# EAGLE design TBA820-Amplifier-Stripboard (EAGLE 7.2.0)
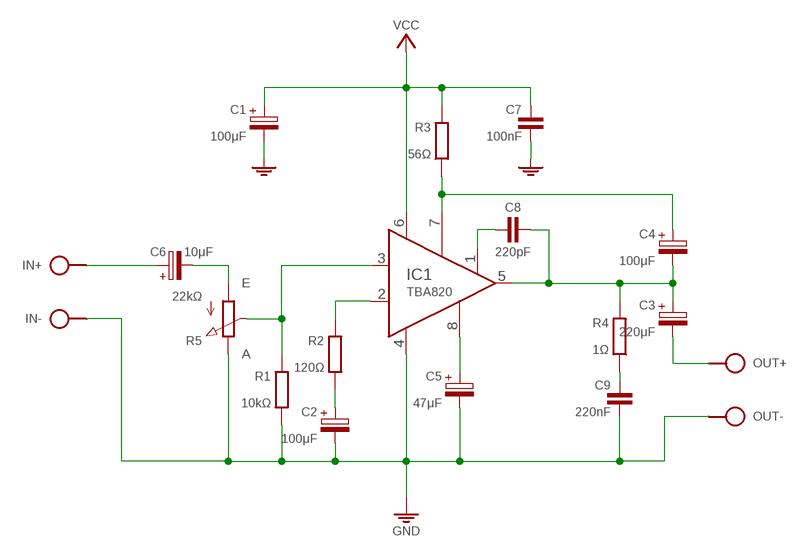
[diagram p0: schematic, sheet 1]

## Parts
C1  100μF  CPOLE2,5-4/V  [E2.5-4/V]
C2  100μF  CPOLE2,5-4/V  [E2.5-4/V]
C3  220μF  CPOLE2.5-5  [E2,5-5]
C4  100μF  CPOLE5-4  [E5-4]
C5  47μF  CPOLE2,5-3  [E2,5-3]
C6  10μF  CPOL-HE2,5-3  [E2,5-3]
C7  100nF  C025-024X044  [C025-024X044]
C8  220pF  C-H050-024X044/V  [C050-024X044/V]
C9  220nF  C075-020X044  [C075-020X044]
IC1  TBA820  [DIL08]
IN  SPAD+--+  [SPAD-+]
OUT  SPAD+-+-  [SPAD+-]
R1  10kΩ  R0202/2V  [0202/2V]
R2  120Ω  R0204/10-V  [0204/10-V]
R3  56Ω  R0202/2V  [0202/2V]
R4  1Ω  R0204/10-V  [0204/10-V]
R5  22kΩ  POT-3P  [CONN-3P]
S4  VCC_GNDPWR-R  [PWR-R]

## Nets
BOOT: C4.+ IC1.7(BOOT) R3.2
FREQ: C8.1 IC1.1(FREQ)
GAIN: IC1.2(GAIN) R2.1
GND: C1.- C2.- C5.- C7.2 C9.2 IC1.4(GND) IN.1 OUT.1 R1.2 R5.3(E) S4.1
INPUT: IC1.3(INPUT) R1.1 R5.2(S)
N$4: C9.1 R4.2
N$5: C6.- R5.1(A)
N$6: C6.+ IN.2
N$10: C3.- OUT.2
N$11: C2.+ R2.2
OUT: C3.+ C4.- C8.2 IC1.5(OUT) R4.1
RIPPLE: C5.+ IC1.8(RIPPLE)
VCC: C1.+ C7.1 IC1.6(VCC) R3.1 S4.2

## Library data of the parts
C1-C5 = c:CPOL: POLARIZED CAPACITOR, European symbol
C6 = c:CPOL-H
C7 C9 = c:C: CAPACITOR, European symbol
C8 = c:C-H
IC1 = ic:TBA820
IN OUT = pad:SPAD+-
R1-R4 = r:R: RESISTOR, European symbol
R5 = r:POT
S4 = pad:VCC_GND

## Board
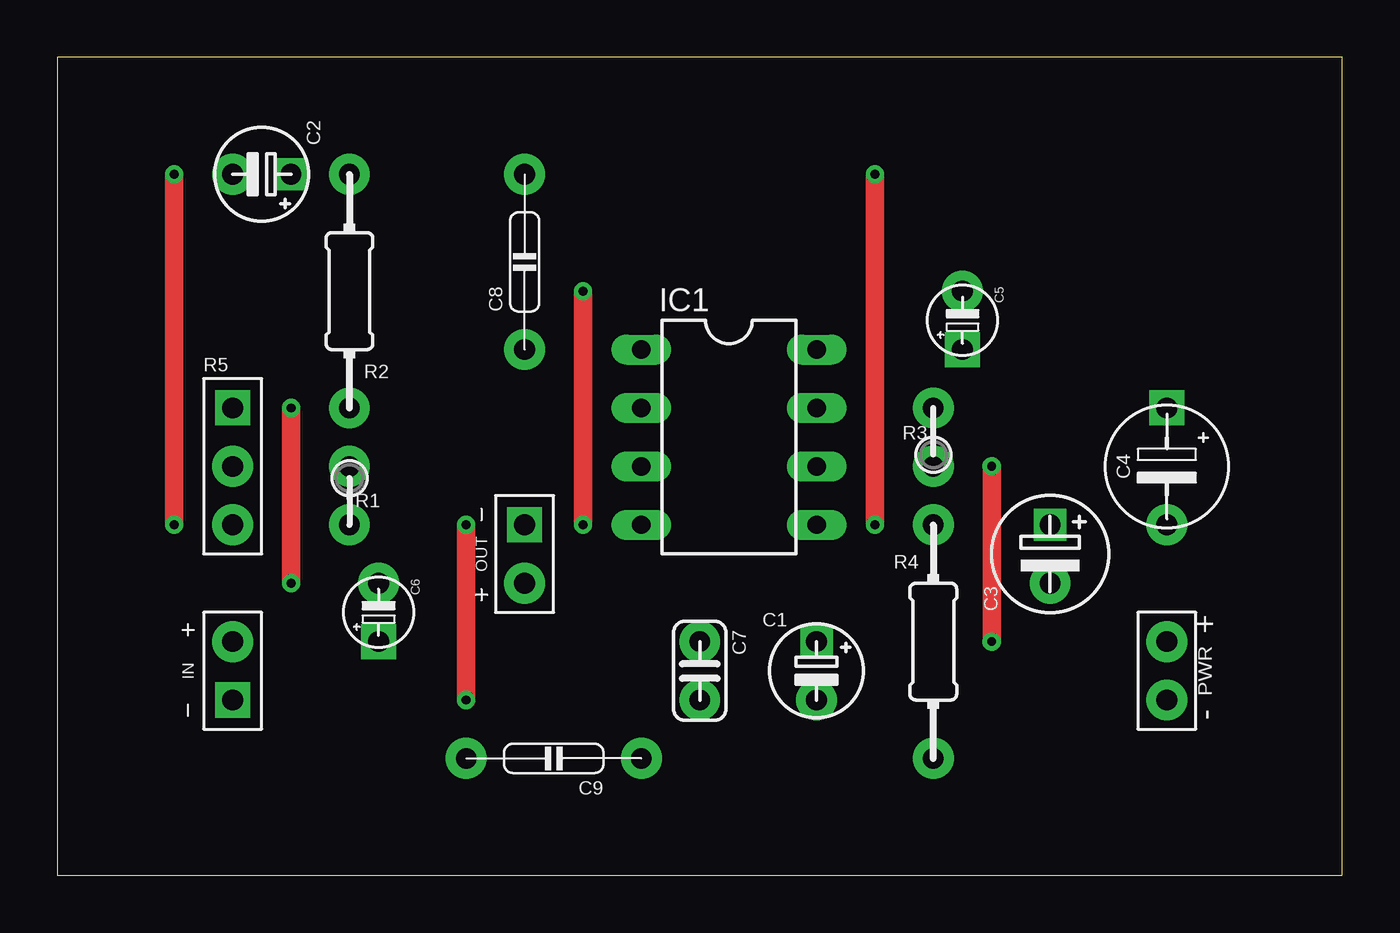
[diagram p1: board, top side]
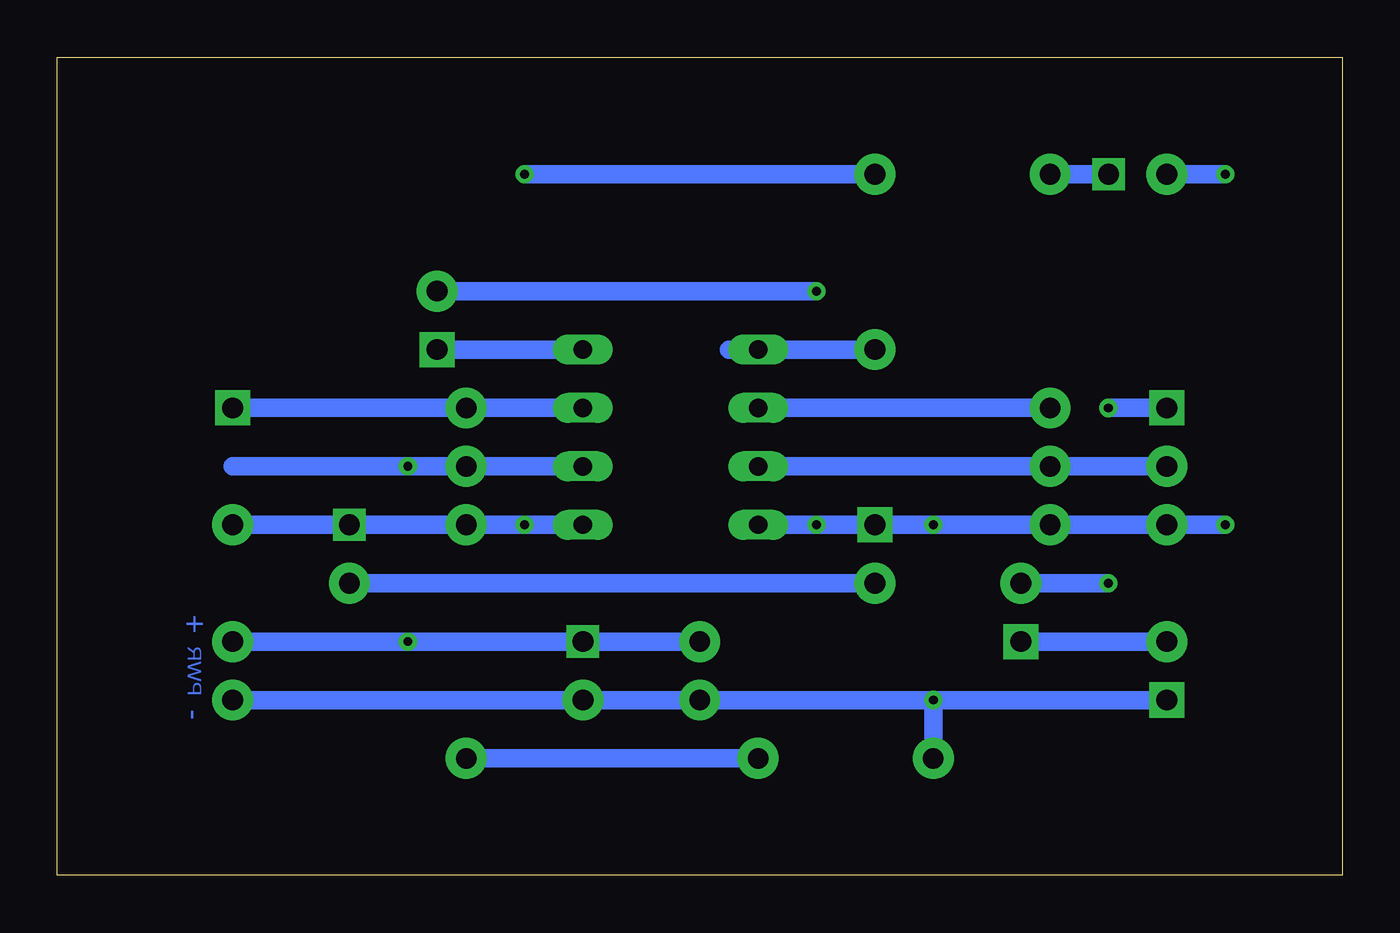
[diagram p2: board, bottom side, seen from below]

Size 55.88 x 35.56 mm. Coordinates in mm from the lower left corner, seen from the top.
Outline: 0,0 55.88,0 55.88,35.56 0,35.56 0,0
Copper layers (1*16): Top 0.035mm / dielectric 1.5mm / Bottom 0.035mm
Design rules "default": minimum track width 10mil, minimum drill 24mil, track to track 8mil, track to pad 8mil, pad to pad 8mil, via to via 8mil, smd to smd 8mil, copper to edge 40mil, drill to drill 8mil, minimum pad ring 10mil, minimum via ring 8mil, stop-mask expansion 4mil, vias tented up to drill 0mil, thermal gap 10mil

### Footprints (pad centres in the part's own frame; a part is rotated, then mirrored left to right if it is on the bottom)
E2.5-4/V = drill 0.9 square: + 0,1.27 | drill 0.9 pad 1.778: - 0,-1.27
E2,5-5 = drill 0.9 square: + 1.27,0 | drill 0.9 pad 1.778: - -1.27,0
E5-4 = drill 0.9 pad 1.524 square: + -2.54,0 | drill 0.9 pad 1.778: - 2.54,0
E2,5-3 = drill 0.9 pad 1.524 square: + -1.27,0 | drill 0.9 pad 1.778: - 1.27,0
C025-024X044 = drill 0.9 pad 1.778: 1 -1.27,0; 2 1.27,0
C075-020X044 = drill 0.9 pad 1.778: 1 -2.54,0; 2 5.08,0
DIL08 = drill 0.8 pad 1.27 long: 1 -3.81,3.81; 2 -3.81,1.27; 3 -3.81,-1.27; 4 -3.81,-3.81; 5 3.81,-3.81; 6 3.81,-1.27; 7 3.81,1.27; 8 3.81,3.81
SPAD-+ = drill 0.9 pad 1.524 square: 1 0,-1.27 | drill 0.9 pad 1.778: 2 0,1.27
SPAD+- = drill 0.9 pad 1.524 square: 1 0,-1.27 | drill 0.9 pad 1.778: 2 0,1.27
0202/2V = drill 0.9 pad 1.778: 1 0,-1.27; 2 0,1.27
0204/10-V = drill 0.9 pad 1.778: 1 0,5.08; 2 0,-5.08
CONN-3P = drill 0.9 pad 1.524 square: 1 0,2.54 | drill 0.9 pad 1.778: 2 0,0; 3 0,-2.54
PWR-R = drill 0.9 pad 1.778: 1 0,-1.27; 2 0,1.27

### Placement (x,y rotation side)
C1  33.02,8.89 0 top
C2  8.89,30.48 270 top
C3  43.18,13.97 90 top
C4  48.26,17.78 270 top
C5  39.37,24.13 90 top
C6  13.97,11.43 90 top
C7  27.94,8.89 270 top
C8  220pF  [C075-020X044]  20.32,25.4 90 top
C9  22.86,5.08 180 top
IC1  29.21,19.05 0 top
IN  7.62,8.89 0 top
OUT  20.32,13.97 180 top
R1  12.7,16.51 180 top
R2  12.7,25.4 180 top
R3  38.1,19.05 0 top
R4  38.1,10.16 0 top
R5  [CONN-3P]  7.62,17.78 0 top
S4  48.26,8.89 0 top

### Tracks (layer width: path | path; a pad name or v marks a point on that pad's centre or on a via)
BOOT
  Bottom 0.813: C4.+ R3.2 IC1.7
FREQ
  Bottom 0.813: 26.67,22.86 IC1.1 C8.1
GAIN
  Bottom 0.813: IC1.2 R2.1
GND  (via drill 0.38)
  Top 0.813: v22.86,25.4 v22.86,15.24 | v5.08,30.48 v5.08,15.24 | v17.78,15.24 v17.78,7.62
  Bottom 0.813: C5.- v22.86,25.4 | C2.- v5.08,30.48 | v5.08,15.24 R5.3 R1.2 v17.78,15.24 OUT.1 v22.86,15.24 IC1.4 | S4.1 C1.- C7.2 v17.78,7.62 | v17.78,7.62 IN.1 | v17.78,7.62 C9.2
INPUT
  Bottom 0.813: IC1.3 R1.1 R5.2
N$4
  Bottom 0.813: R4.2 C9.1
N$5  (via drill 0.38)
  Top 0.813: v10.16,12.7 v10.16,20.32
  Bottom 0.813: C6.- v10.16,12.7 | v10.16,20.32 R5.1
N$6
  Bottom 0.813: C6.+ IN.2
N$10
  Bottom 0.813: C3.- OUT.2
N$11
  Bottom 0.813: R2.2 C2.+
OUT  (via drill 0.38)
  Top 0.813: v35.56,15.24 v35.56,30.48
  Bottom 0.813: C4.- C3.+ R4.1 v35.56,15.24 IC1.5 | v35.56,30.48 C8.2
RIPPLE
  Bottom 0.813: C5.+ IC1.8
VCC  (via drill 0.38)
  Top 0.813: v40.64,10.16 v40.64,17.78
  Bottom 0.813: 48.26,17.78 R3.1 v40.64,17.78 IC1.6 | C7.1 C1.+ v40.64,10.16 S4.2